# EAGLE design 902_kerberos (EAGLE 9.6.2)
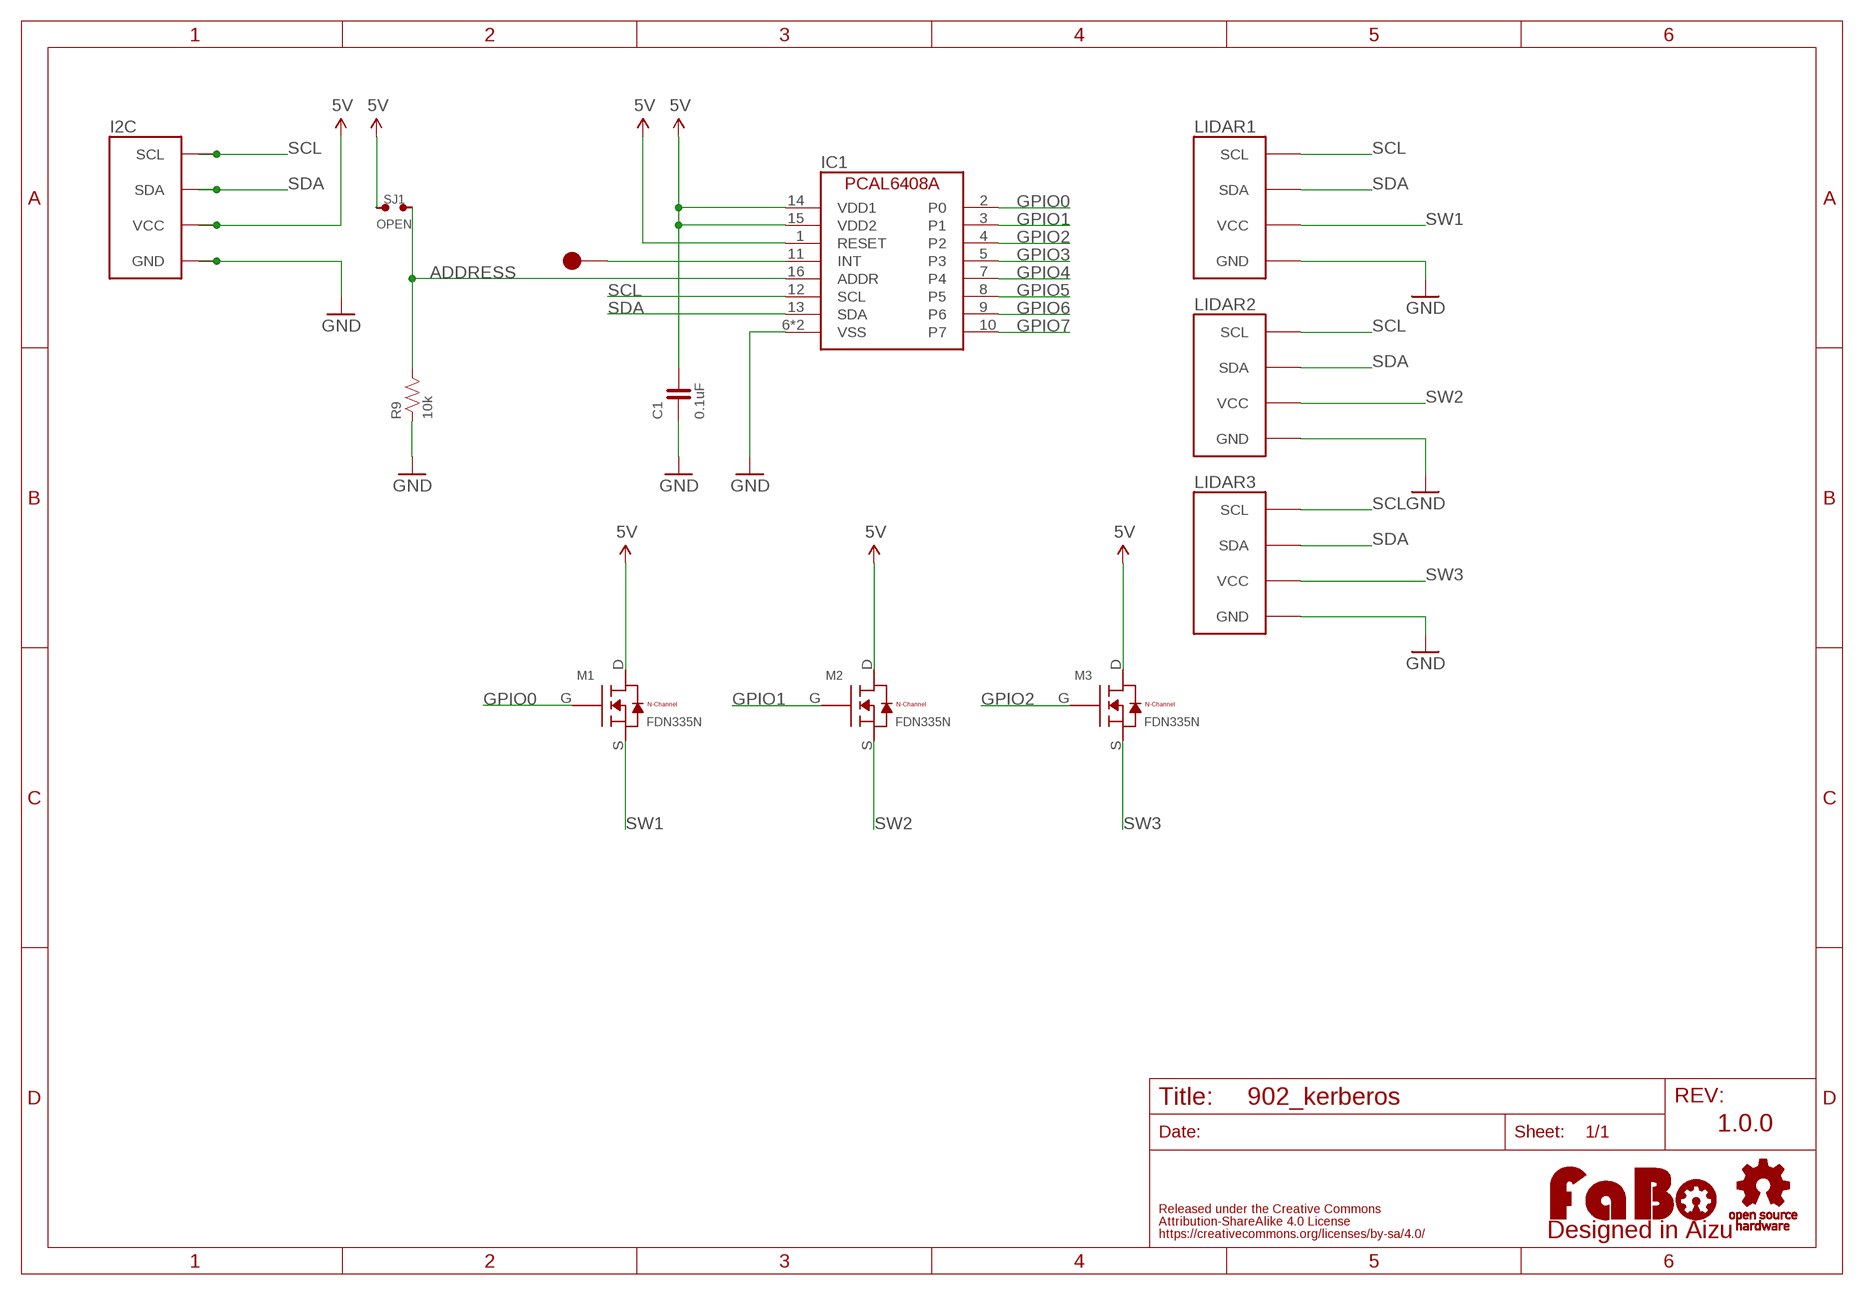
[diagram p0: schematic, sheet 1]

## Parts
C1  0.1uF  CAPACITOR-0603  [0603]
I2C  FABO_BRICK_I2C-S04B-PASK-2  [FABO_BRICK_I2C_S04B-PASK-2]
IC1  NX-PCAL6408A  [NXP-PCAL6408A]
LIDAR1  FABO_BRICK_I2C-S04B-PASK-2  [FABO_BRICK_I2C_S04B-PASK-2]
LIDAR2  FABO_BRICK_I2C-S04B-PASK-2  [FABO_BRICK_I2C_S04B-PASK-2]
LIDAR3  FABO_BRICK_I2C-S04B-PASK-2  [FABO_BRICK_I2C_S04B-PASK-2]
M1  FDN335N  MOSFET-N_FDN335N  [SUPERSOT-3]
M2  FDN335N  MOSFET-N_FDN335N  [SUPERSOT-3]
M3  FDN335N  MOSFET-N_FDN335N  [SUPERSOT-3]
R9  10k  RESISTOR-0603-NARROW  [0603-NARROW]
SJ1  OPEN  SMD-JUMPER-2-OPEN  [SMD-JUMPER-2-OPEN]
TP1  TP-15  [TP-15]
U$2  LOGO_OSHW-M  [LOGO_OSHW_M]
U$3  LOGO_FABO-M  [LOGO_FABO_MS]

## Nets
5V: C1.2 I2C.VCC IC1.1(RESET) IC1.14(VDD1) IC1.15(VDD2) M1.D M2.D M3.D SJ1.1
ADDRESS: IC1.16(ADDR) R9.2 SJ1.2
GND: C1.1 I2C.GND IC1.6(VSS) IC1.17(VSS) LIDAR1.GND LIDAR2.GND LIDAR3.GND R9.1
GPIO0: IC1.2(P0) M1.G
GPIO1: IC1.3(P1) M2.G
GPIO2: IC1.4(P2) M3.G
GPIO3: IC1.5(P3)
GPIO4: IC1.7(P4)
GPIO5: IC1.8(P5)
GPIO6: IC1.9(P6)
GPIO7: IC1.10(P7)
INT: IC1.11(INT) TP1.1
SCL: I2C.SCL IC1.12(SCL) LIDAR1.SCL LIDAR2.SCL LIDAR3.SCL
SDA: I2C.SDA IC1.13(SDA) LIDAR1.SDA LIDAR2.SDA LIDAR3.SDA
SW1: LIDAR1.VCC M1.S
SW2: LIDAR2.VCC M2.S
SW3: LIDAR3.VCC M3.S

## Notes on the sheet
- 1.0.0

## Library data of the parts
C1 = FaBo-Capacitor:CAPACITOR: CAPACITOR
I2C LIDAR1-LIDAR3 = FaBo-Template:FABO_BRICK_I2C: FaBo Brick I2C
IC1 = FaBo-Mems:NX-PCAL6408A: NXP PCAL6408A
M1-M3 = FaBo-Mosfet:MOSFET-N
R9 = FaBo-Resistors:RESISTOR: RESISTOR
SJ1 = FaBo-Supply:SMD-JUMPER-2
TP1 = FaBo-Supply:TP
U$2 = FaBo-Logo:LOGO_OSHW
U$3 = FaBo-Logo:LOGO_FABO

## Board
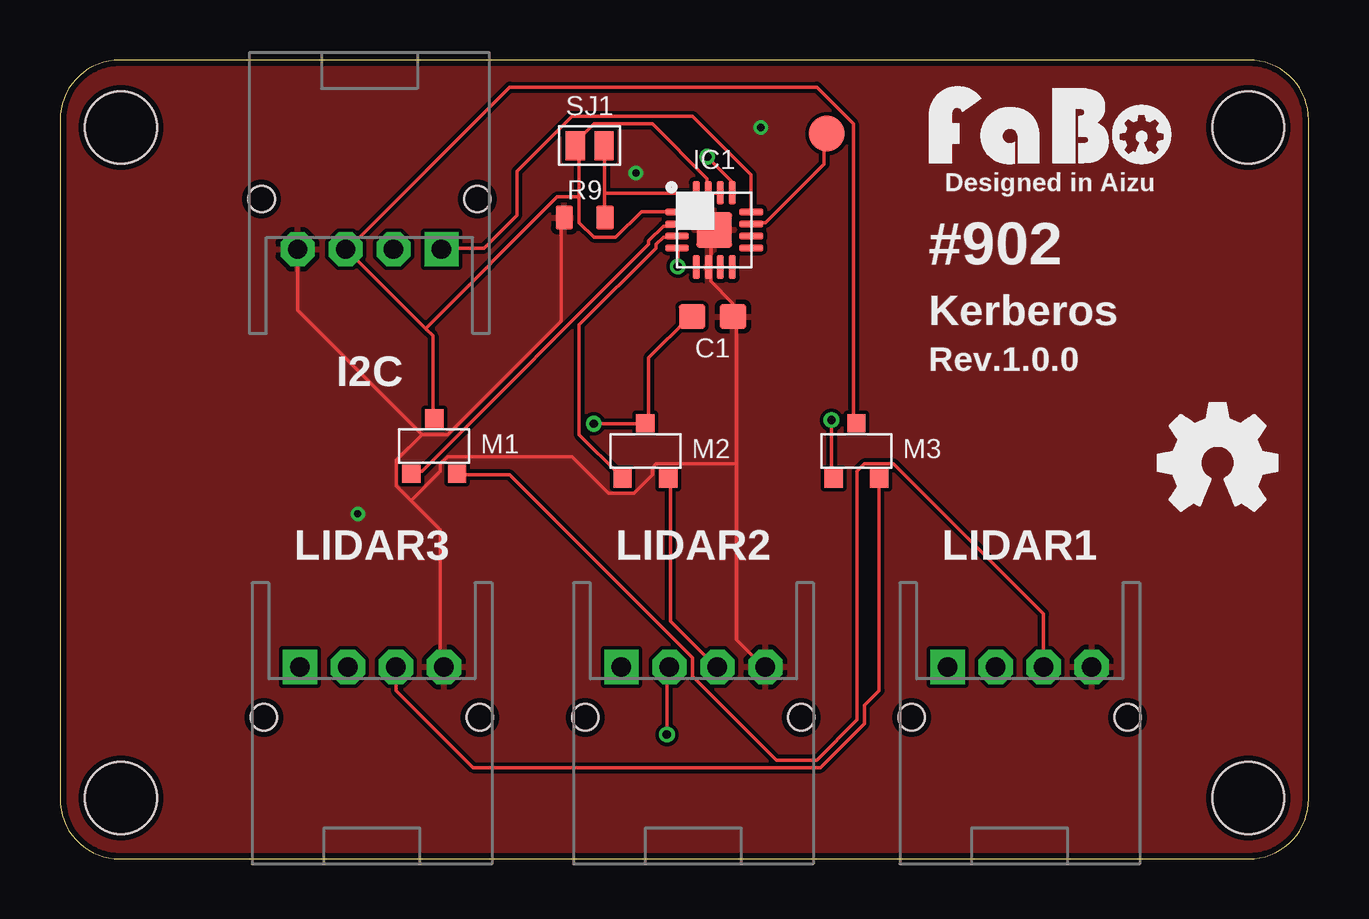
[diagram p1: board, top side]
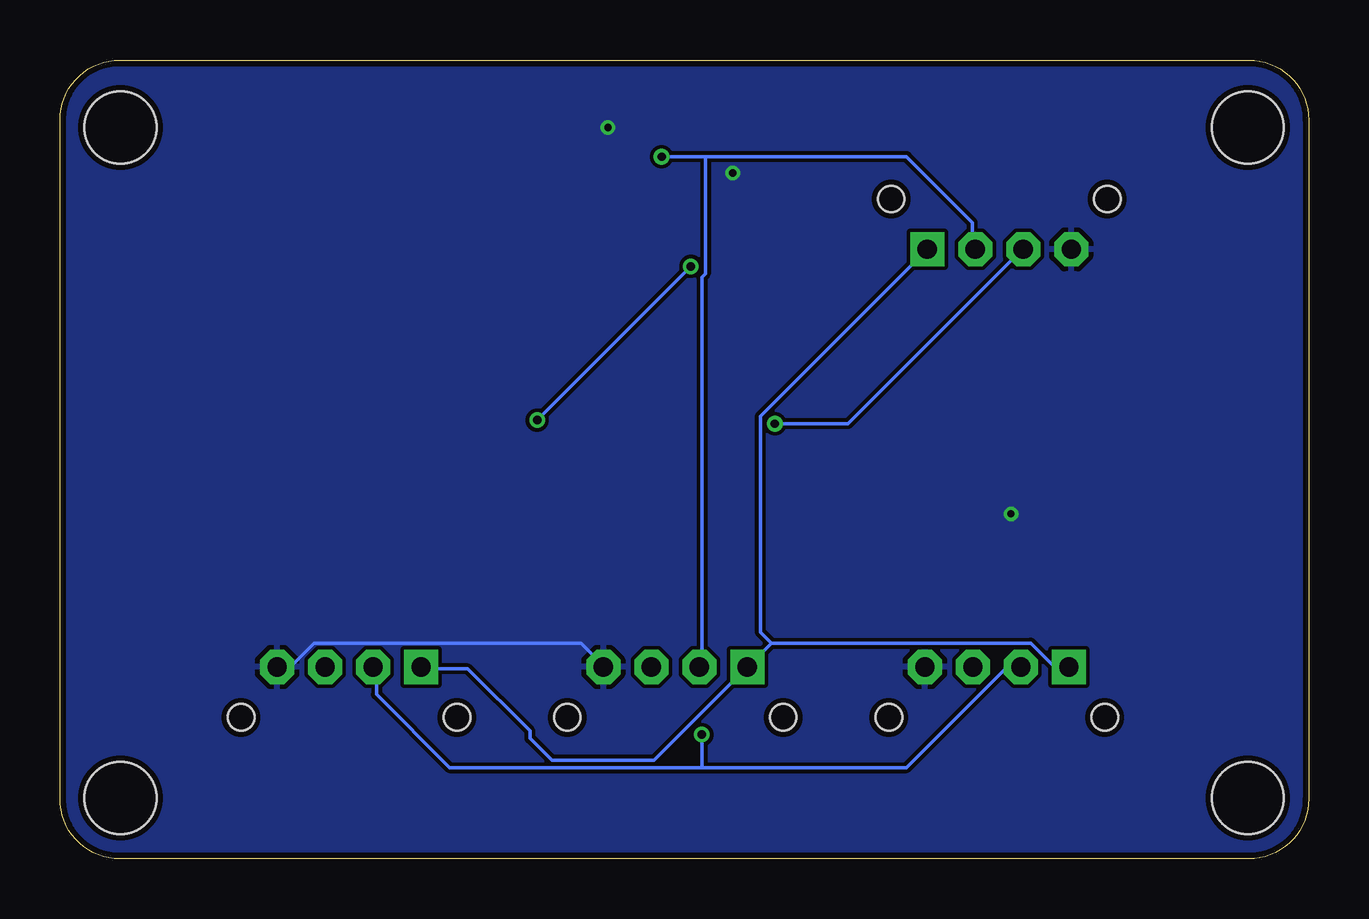
[diagram p2: board, bottom side, seen from below]

Size 52.05 x 33.29 mm. Coordinates in mm from the lower left corner, seen from the top.
Outline: 2.5,0 49.55,0 arc90 52.05,2.5 52.05,30.79 arc90 49.55,33.29 2.5,33.29 arc90 0,30.79 0,2.5 arc90 2.5,0
Copper layers (1*16): Top 0.035mm / dielectric 1.6mm / Bottom 0.035mm
Design rules "PCBway": minimum track width 6mil, minimum drill 12mil, track to track 6mil, track to pad 6mil, pad to pad 6mil, via to via 6mil, smd to smd 6mil, copper to edge 10mil, drill to drill 10mil, minimum pad ring 10mil, minimum via ring 6mil, stop-mask expansion 2mil, vias tented up to drill 100mil, thermal gap 8mil
Holes 3 mm at 2.54,30.48 49.53,30.48 49.53,2.54 2.54,2.54

### Footprints (pad centres in the part's own frame; a part is rotated, then mirrored left to right if it is on the bottom)
0603 = smd 1.1 x 1: 1 -0.85,0; 2 0.85,0
FABO_BRICK_I2C_S04B-PASK-2 = drill 0.8 pad 1.422 octagon: GND -3,0; SDA 1,0; VCC -1,0 | drill 0.8 pad 1.422 square: SCL 3,0 | hole 1.1: 4.5,2.1; -4.5,2.1
NXP-PCAL6408A = smd 1 x 0.3: 1 -1.55,0.75; 2 -1.55,0.25; 3 -1.55,-0.25; 4 -1.55,-0.75; 9 1.55,-0.75; 10 1.55,-0.25; 11 1.55,0.25; 12 1.55,0.75 | smd 0.3 x 1: 5 -0.75,-1.55; 6 -0.25,-1.55; 7 0.25,-1.55; 8 0.75,-1.55; 13 0.75,1.55; 14 0.25,1.55; 15 -0.25,1.55; 16 -0.75,1.55 | smd 1.5 x 1.5: 17 0,0
SUPERSOT-3 = smd 0.76 x 0.76: D 0,1.15; G -0.95,-1.15; S 0.95,-1.15
0603-NARROW = smd 0.71 x 1: 1 -0.85,0; 2 0.85,0
SMD-JUMPER-2-OPEN = smd 0.8 x 1.2: 1 -0.6,0; 2 0.6,0
TP-15 = smd 1.5 x 1.5: 1 0,0

### Placement (x,y rotation side)
C1  27.2,22.6 180 top
I2C  12.9,25.4 0 top
IC1  27.27,26.21 0 top
LIDAR1  40,8 180 top
LIDAR2  26.4,8 180 top
LIDAR3  13,8 180 top
M1  15.6,17.2 0 top
M2  24.4,17 0 top
M3  33.2,17 0 top
R9  21.87,26.72 0 top
SJ1  22.08,29.72 0 top
TP1  31.96,30.22 0 top
U$2  48.26,16.51 0 top
U$3  41.27,28.57 0 top

### Tracks (layer width: path | path; a pad name or v marks a point on that pad's centre or on a via)
5V  (via drill 0.35)
  Top 0.152: IC1.14 27.43,27.74 27.13,27.74 IC1.15 26.98,27.89 26.98,28.35 24.69,30.63 22.25,30.63 21.49,29.87 SJ1.1 21.64,29.57 21.64,27.58 | 21.64,27.58 21.64,26.52 22.25,25.91 23.16,25.91 24.23,26.98 25.6,26.98 IC1.1 | C1.2 26.21,22.55 24.54,20.88 24.54,18.29 M2.D 24.38,18.14 v22.25,18.14 | 15.24,22.1 12.04,25.3 I2C.VCC 12.04,25.45 18.75,32.16 31.55,32.16 33.07,30.63 33.07,18.29 M3.D | 15.24,22.1 15.54,21.79 15.54,18.44 M1.D | 21.64,27.58 20.73,27.58 15.24,22.1
  Bottom 0.152: v22.25,18.14 19.2,18.14 12.04,25.3 I2C.VCC
ADDRESS
  Top 0.152: 22.71,27.74 22.71,29.72 SJ1.2 | 22.71,27.74 22.71,26.82 R9.2 | 22.71,27.74 26.52,27.74 IC1.16
GND  (via drill 0.3)
  Top 0.152: 15.09,17.68 16.15,17.68 20.88,22.4 20.88,26.67 R9.1 | 15.09,17.68 9.91,22.86 9.91,25.3 I2C.GND | 14.63,14.94 14.02,15.54 14.02,16.61 15.09,17.68 | 14.63,14.94 15.85,13.72 15.85,8.08 LIDAR3.GND | IC1.17 27.13,26.06 27.13,24.69 IC1.6 27.13,24.54 27.13,24.08 28.04,23.16 28.04,22.71 C1.1 28.19,22.55 28.19,16.46 | 28.19,16.46 28.19,9.14 29.26,8.08 LIDAR2.GND | 14.63,14.94 15.85,16.15 15.85,16.46 16.15,16.76 21.34,16.76 22.86,15.24 23.93,15.24 24.69,16 24.69,16.31 24.84,16.46 28.19,16.46
  Bottom 0.152: LIDAR1.GND 42.98,8.08 42.37,8.08 41.45,8.99 30.33,8.99 29.41,8.08 LIDAR2.GND
  other vias: 29.21,30.48 24.01,28.58 12.41,14.38
  pour Top: 0,0 52.07,0 52.07,33.66 0,33.66
  pour Bottom: 0,0 52.07,0 52.07,33.66 0,33.66
GPIO0
  Top 0.152: M1.G 14.78,16.15 15.09,16.15 24.54,25.6 24.54,25.76 25.15,26.36 25.6,26.36 IC1.2
GPIO1
  Top 0.152: M2.G 23.32,16 21.64,17.68 21.64,22.25 24.84,25.45 24.84,25.6 25.15,25.91 25.6,25.91 IC1.3
GPIO2  (via drill 0.35)
  Top 0.152: v32.16,18.29 32.16,16 M3.G | v25.76,24.69 25.76,25.45 IC1.4
  Bottom 0.152: v25.76,24.69 v32.16,18.29
INT
  Top 0.152: IC1.11 28.96,26.52 29.41,26.52 31.85,28.96 31.85,30.18 TP1.1
SCL
  Top 0.152: IC1.12 28.8,26.98 28.8,28.5 26.36,30.94 21.34,30.94 19.05,28.65 19.05,26.82 17.68,25.45 16,25.45 I2C.SCL
  Bottom 0.152: 22.4,8.99 11.58,8.99 10.67,8.08 10.06,8.08 LIDAR3.SCL | 22.4,8.99 23.32,8.08 LIDAR2.SCL 23.47,7.92 27.28,4.12 31.55,4.12 32.46,5.03 32.46,5.33 35.05,7.92 36.88,7.92 LIDAR1.SCL | 22.4,8.99 22.86,9.45 22.86,18.44 16,25.3 I2C.SCL
SDA  (via drill 0.35)
  Top 0.152: v26.98,29.26 28.04,28.19 28.04,27.89 IC1.13 | v25.3,5.18 25.3,7.92 LIDAR2.SDA
  Bottom 0.152: 25.3,3.81 35.81,3.81 38.86,6.86 38.86,7.92 LIDAR1.SDA | 25.3,3.81 16.76,3.81 12.65,7.92 12.04,7.92 LIDAR3.SDA | 25.15,29.26 16.76,29.26 14.02,26.52 14.02,25.45 I2C.SDA | 25.15,29.26 v26.98,29.26 | 25.15,29.26 25.15,24.38 25.3,24.23 25.3,8.08 LIDAR2.SDA | v25.3,5.18 25.3,3.81
SW1
  Top 0.152: M1.S 16.61,16 18.75,16 26.36,8.38 26.36,7.62 29.87,4.12 31.55,4.12 33.22,5.79 33.22,16.15 33.53,16.46 34.75,16.46 41,10.21 41,8.08 LIDAR1.VCC
SW2
  Top 0.152: M2.S 25.45,15.85 25.45,9.91 27.28,8.08 LIDAR2.VCC
SW3
  Top 0.152: M3.S 34.14,15.85 34.14,7.01 33.53,6.4 33.53,5.64 31.7,3.81 17.22,3.81 14.02,7.01 14.02,7.92 LIDAR3.VCC

### Text on the board
tPlace: Designed in Aizu | #902 | Kerberos | Rev.1.0.0